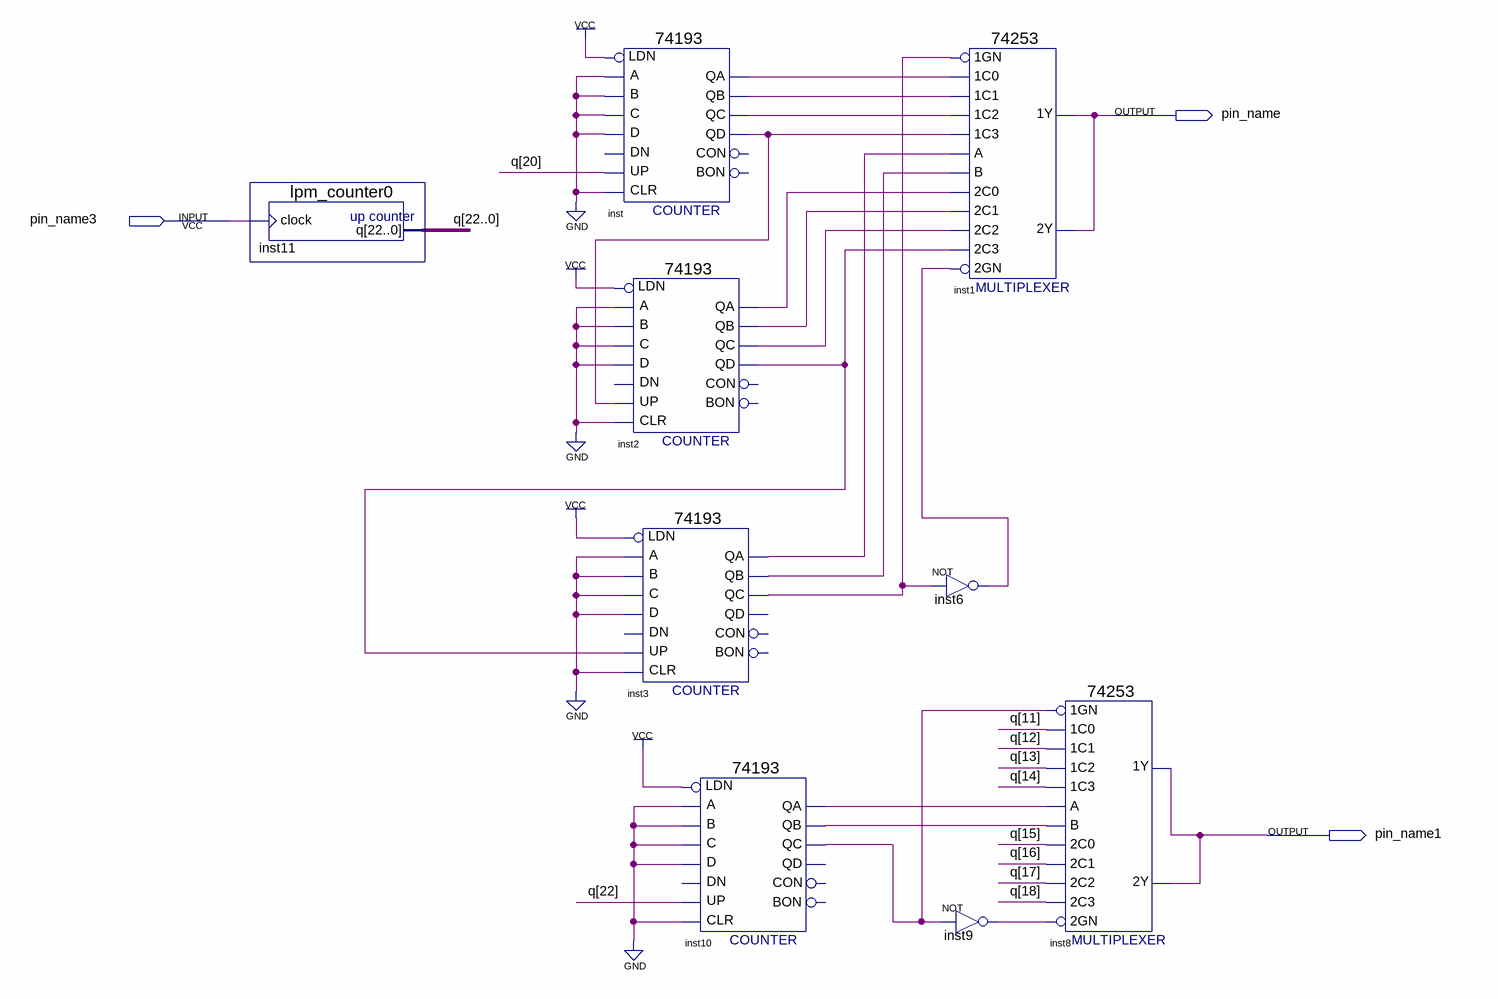
[diagram p0: schematic sheet]
// Quartus schematic lab2_1.bdf as structural Verilog: 9 symbols, 3 pins
module lab2_1 (
  input  pin_name3,
  output pin_name,
  output pin_name1
);

  wire inst2_qa, inst2_qb, inst2_qc, inst2_qd, inst3_qa, inst3_qb, inst3_qc, inst6_out, inst9_out, inst10_qa,
       inst10_qb, inst10_qc, inst_qa, inst_qb, inst_qc, inst_qd;
  wire [22:0] q;

  lpm_counter0 inst11 (.clock(pin_name3), .q(q));
  \74193  inst (
    .D(1'b0), .C(1'b0), .B(1'b0), .A(1'b0), .CLR(1'b0), .UP(q[20]), .LDN(1'b1), .QB(inst_qb), .QA(inst_qa),
    .QD(inst_qd), .QC(inst_qc));  // open: DN, CON, BON
  \74193  inst2 (
    .D(1'b0), .C(1'b0), .B(1'b0), .A(1'b0), .CLR(1'b0), .UP(inst_qd), .LDN(1'b1), .QB(inst2_qb),
    .QA(inst2_qa), .QD(inst2_qd), .QC(inst2_qc));  // open: DN, CON, BON
  \74193  inst3 (
    .D(1'b0), .C(1'b0), .B(1'b0), .A(1'b0), .CLR(1'b0), .UP(inst2_qd), .LDN(1'b1), .QB(inst3_qb),
    .QA(inst3_qa), .QC(inst3_qc));  // open: DN, CON, QD, BON
  \74193  inst10 (
    .D(1'b0), .C(1'b0), .B(1'b0), .A(1'b0), .CLR(1'b0), .UP(q[22]), .LDN(1'b1), .QB(inst10_qb),
    .QA(inst10_qa), .QC(inst10_qc));  // open: DN, CON, QD, BON
  \74253  inst1 (
    .\1GN (inst3_qc), .\1C3 (inst_qd), .\1C2 (inst_qc), .\2C2 (inst2_qc), .\2C3 (inst2_qd), .\1C1 (inst_qb),
    .\1C0 (inst_qa), .\2C1 (inst2_qb), .\2C0 (inst2_qa), .B(inst3_qb), .A(inst3_qa), .\2GN (inst6_out),
    .\2Y (pin_name), .\1Y (pin_name));
  not inst6 (inst6_out, inst3_qc);
  not inst9 (inst9_out, inst10_qc);
  \74253  inst8 (
    .\1GN (inst10_qc), .\1C3 (q[14]), .\1C2 (q[13]), .\2C2 (q[17]), .\2C3 (q[18]), .\1C1 (q[12]),
    .\1C0 (q[11]), .\2C1 (q[16]), .\2C0 (q[15]), .B(inst10_qb), .A(inst10_qa), .\2GN (inst9_out),
    .\2Y (pin_name1), .\1Y (pin_name1));
endmodule
